# Altium schematic sheet Power.SchDoc
size A4
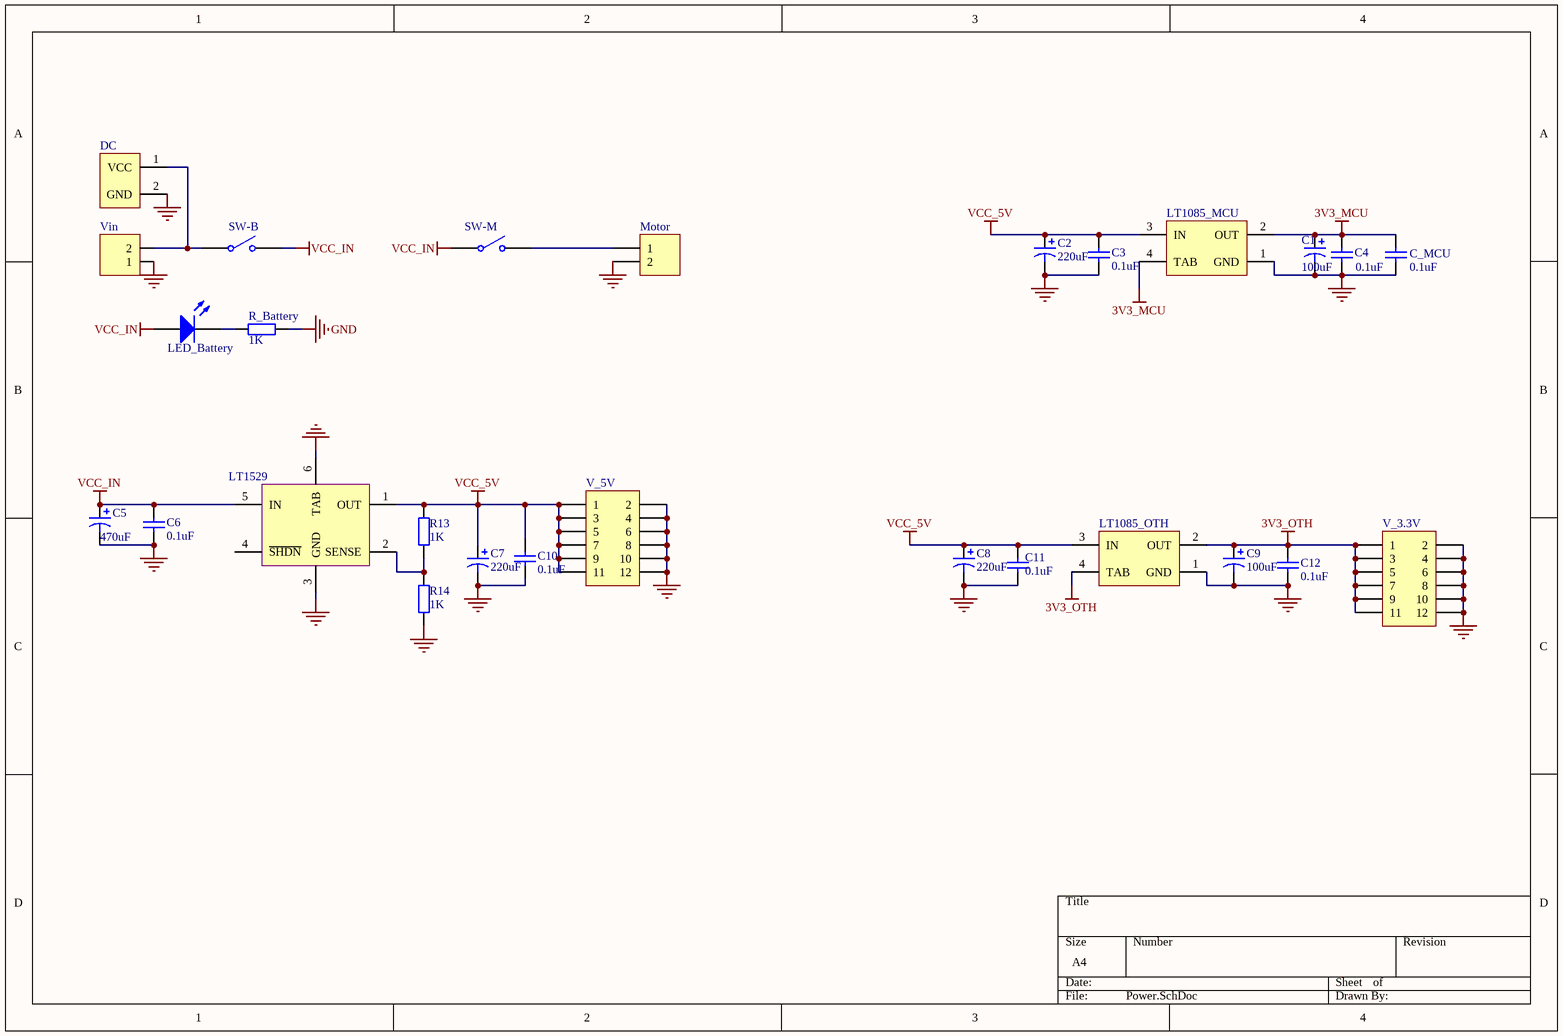
[diagram p0: Power.SchDoc]

## Parts
C1  100uf  [100uf-25V]
C2  220uf  [220UF-25V]
C3  0.1uf  [0805-S]
C4  0.1uf  [0805-S]
C5  470uf  [220UF-25V]
C6  0.1uF  [0805-S]
C7  220uf  [220UF-25V]
C8  220uf  [220UF-25V]
C9  100uf  [100uf-25V]
C10  0.1uF  [0805-S]
C11  0.1uf  [0805-S]
C12  0.1uf  [0805-S]
C_MCU  0.1uf  [0805-S]
DC  DC0005  [DC]  (value not drawn)
LED_Battery  LED  [0805-S]  (value not drawn)
LT1085_MCU  LT1085-3.3  [TS3B_N]  (value not drawn)
LT1085_OTH  LT1085-3.3  [TS3B_N]  (value not drawn)
LT1529  LT1529  [TS5B]  (value not drawn)
Motor  Header 2  [Head2_small]  (value not drawn)
R13  1K  [0805-S]
R14  1K  [0805-S]
R_Battery  1K  [0805-S]
SW-B  SW-TOGGLE  [SW-TOGGLE]  (value not drawn)
SW-M  SW-TOGGLE  [SW-TOGGLE]  (value not drawn)
V_3.3V  Header 6X2  [HDR2X6]  (value not drawn)
V_5V  Header 6X2  [HDR2X6]  (value not drawn)
Vin  Header 2  [Head2_small]  (value not drawn)

## Nets
3V3_MCU: C1.1 C4.2 C_MCU.2 LT1085_MCU.2(OUT) LT1085_MCU.4(TAB)
3V3_OTH: C9.1 C12.2 LT1085_OTH.2(OUT) LT1085_OTH.4(TAB) V_3.3V.1 V_3.3V.3 V_3.3V.5 V_3.3V.7 V_3.3V.9 V_3.3V.11
GND: C1.2 C2.2 C3.1 C4.1 C5.2 C6.1 C7.2 C8.2 C9.2 C10.1 C11.1 C12.1 C_MCU.1 DC.2(GND) LT1085_MCU.1(GND) LT1085_OTH.1(GND) LT1529.3(GND) LT1529.6(TAB) Motor.2 R14.1 R_Battery.1 V_3.3V.2 V_3.3V.4 V_3.3V.6 V_3.3V.8 V_3.3V.10 V_3.3V.12 V_5V.2 V_5V.4 V_5V.6 V_5V.8 V_5V.10 V_5V.12 Vin.1
VCC_5V: C2.1 C3.2 C7.1 C8.1 C10.2 C11.2 LT1085_MCU.3(IN) LT1085_OTH.3(IN) LT1529.1(OUT) R13.2 V_5V.1 V_5V.3 V_5V.5 V_5V.7 V_5V.9 V_5V.11
VCC_IN: C5.1 C6.2 LED_Battery.1(A) LT1529.5(IN) SW-B.2(NO) SW-M.1(COMMON)
NetDC_1: DC.1(VCC) SW-B.1(COMMON) Vin.2
NetLED_Battery_2: LED_Battery.2(K) R_Battery.2
NetLT1529_2: LT1529.2(SENSE) R13.1 R14.2
NetMotor_1: Motor.1 SW-M.2(NO)

Not connected (* = marked no-connect by the designer): LT1529 4(~{SHDN})

## Library data of the parts
C1 C2 C5 C7-C9 = Cap Pol1: Polarized Capacitor (Radial); Published: 8-Jun-2000; LatestRevisionDate: 17-Jul-2002; LatestRevisionNote: Re-released for DXP Platform.; PackageReference: RB7.6-15; Publisher: Altium Limited; PackageDescription: Polarized Capacitor (Radial); 2 Leads
  C1 C9: Value: 100uF
  C2 C7 C8: Value: 220uF
  C5: Value: 470uF
C3 C4 C11 C12 C_MCU = Cap: Capacitor; Published: 8-Jun-2000; LatestRevisionDate: 17-Jul-2002; LatestRevisionNote: Re-released for DXP Platform.; PackageReference: RAD-0.3; Publisher: Altium Limited; PackageDescription: Radial Cap, Thru-Hole; 2 Leads; 0.3 in Pin Spacing; Value: 0.1uF
C6 C10 = Cap_1: Capacitor; Published: 8-Jun-2000; LatestRevisionDate: 17-Jul-2002; LatestRevisionNote: Re-released for DXP Platform.; PackageReference: RAD-0.3; Publisher: Altium Limited; Value: 0.1uF
LED_Battery = LED0: Typical INFRARED GaAs LED; Published: 8-Jun-2000; LatestRevisionDate: 08-Jul-2005; LatestRevisionNote: Mech Layer 1 removed.; PackageReference: LED-0; Publisher: Altium Limited
Motor Vin = Header 2: Header, 2-Pin; LatestRevisionDate: 17-Jul-2002; LatestRevisionNote: Re-released for DXP Platform.; Publisher: Altium Limited
R13 R14 = Res2_3: Resistor; Published: 8-Jun-2000; LatestRevisionDate: 17-Jul-2002; LatestRevisionNote: Re-released for DXP Platform.; PackageReference: AXIAL-0.4; Publisher: Altium Limited; Value: 1K
R_Battery = Res2: Resistor; Published: 8-Jun-2000; LatestRevisionDate: 17-Jul-2002; LatestRevisionNote: Re-released for DXP Platform.; PackageReference: AXIAL-0.4; Publisher: Altium Limited; Value: 1K
SW-B SW-M = SW-TOGGLE: Single-Pole, Single-Throw Switch; Published: 24-Mar-1999; LatestRevisionDate: 17-Jul-2002; LatestRevisionNote: Re-released for DXP Platform.; PackageReference: SPST-2; Publisher: Altium Limited
V_3.3V V_5V = Header 6X2: Header, 6-Pin, Dual row; LatestRevisionDate: 17-Jul-2002; LatestRevisionNote: Re-released for DXP Platform.; Publisher: Altium Limited